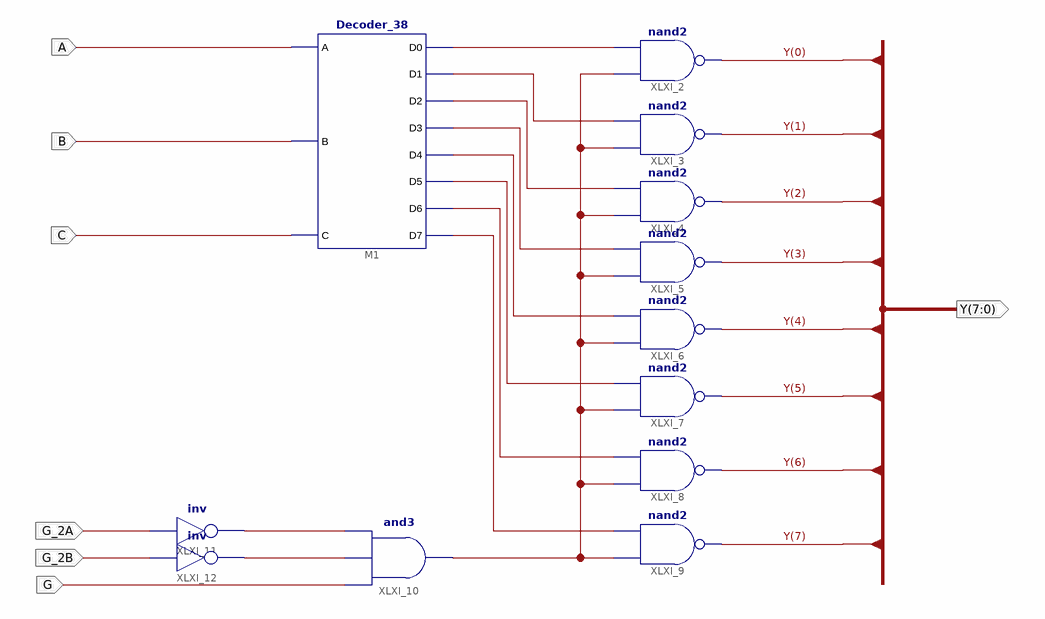
[diagram p0: schematic sheet 1]
// Xilinx ISE schematic HCT138.sch (kintex7) as structural Verilog: 12 symbols, 7 ports
module HCT138 (
  input  A,
  input  B,
  input  C,
  input  G,
  input  G_2A,
  input  G_2B,
  output [7:0] Y
);

  wire XLXN_4, XLXN_5, XLXN_6, XLXN_7, XLXN_8, XLXN_9, XLXN_10, XLXN_11, XLXN_12, XLXN_13, XLXN_27;

  Decoder_38 M1 (
    .A(A), .B(B), .C(C), .D0(XLXN_4), .D1(XLXN_5), .D2(XLXN_6), .D3(XLXN_7), .D4(XLXN_8), .D5(XLXN_9),
    .D6(XLXN_10), .D7(XLXN_11));
  nand XLXI_2 (Y[0], XLXN_27, XLXN_4);
  nand XLXI_3 (Y[1], XLXN_27, XLXN_5);
  nand XLXI_4 (Y[2], XLXN_27, XLXN_6);
  nand XLXI_5 (Y[3], XLXN_27, XLXN_7);
  nand XLXI_6 (Y[4], XLXN_27, XLXN_8);
  nand XLXI_7 (Y[5], XLXN_27, XLXN_9);
  nand XLXI_8 (Y[6], XLXN_27, XLXN_10);
  nand XLXI_9 (Y[7], XLXN_27, XLXN_11);
  and XLXI_10 (XLXN_27, G, XLXN_13, XLXN_12);
  not XLXI_11 (XLXN_12, G_2A);
  not XLXI_12 (XLXN_13, G_2B);
endmodule
